# Altium schematic sheet LVDS_IFC.SchDoc: LVDS Interface
size 420 x 297 mm; Author: G.K.; CompanyName: WUT; DrawnBy: G.K.; Organization: CERN; Address1: Warsaw Univeristy of Technology; Address2: Nowowiejska 15/19; DocumentNumber: 4; Revision: -; SheetNumber: 4; SheetTotal: 5; EDA_Number: ARTIQ; Projet: 3U ADC; ModifiedBy: -; CreateDate: XX/XX/XXXX; CheckedDate: -; Title2: I2C logic; DivGrp: ISE; Designer: G.K.; ModifiedDate: -; ProjectName: 3U ADC
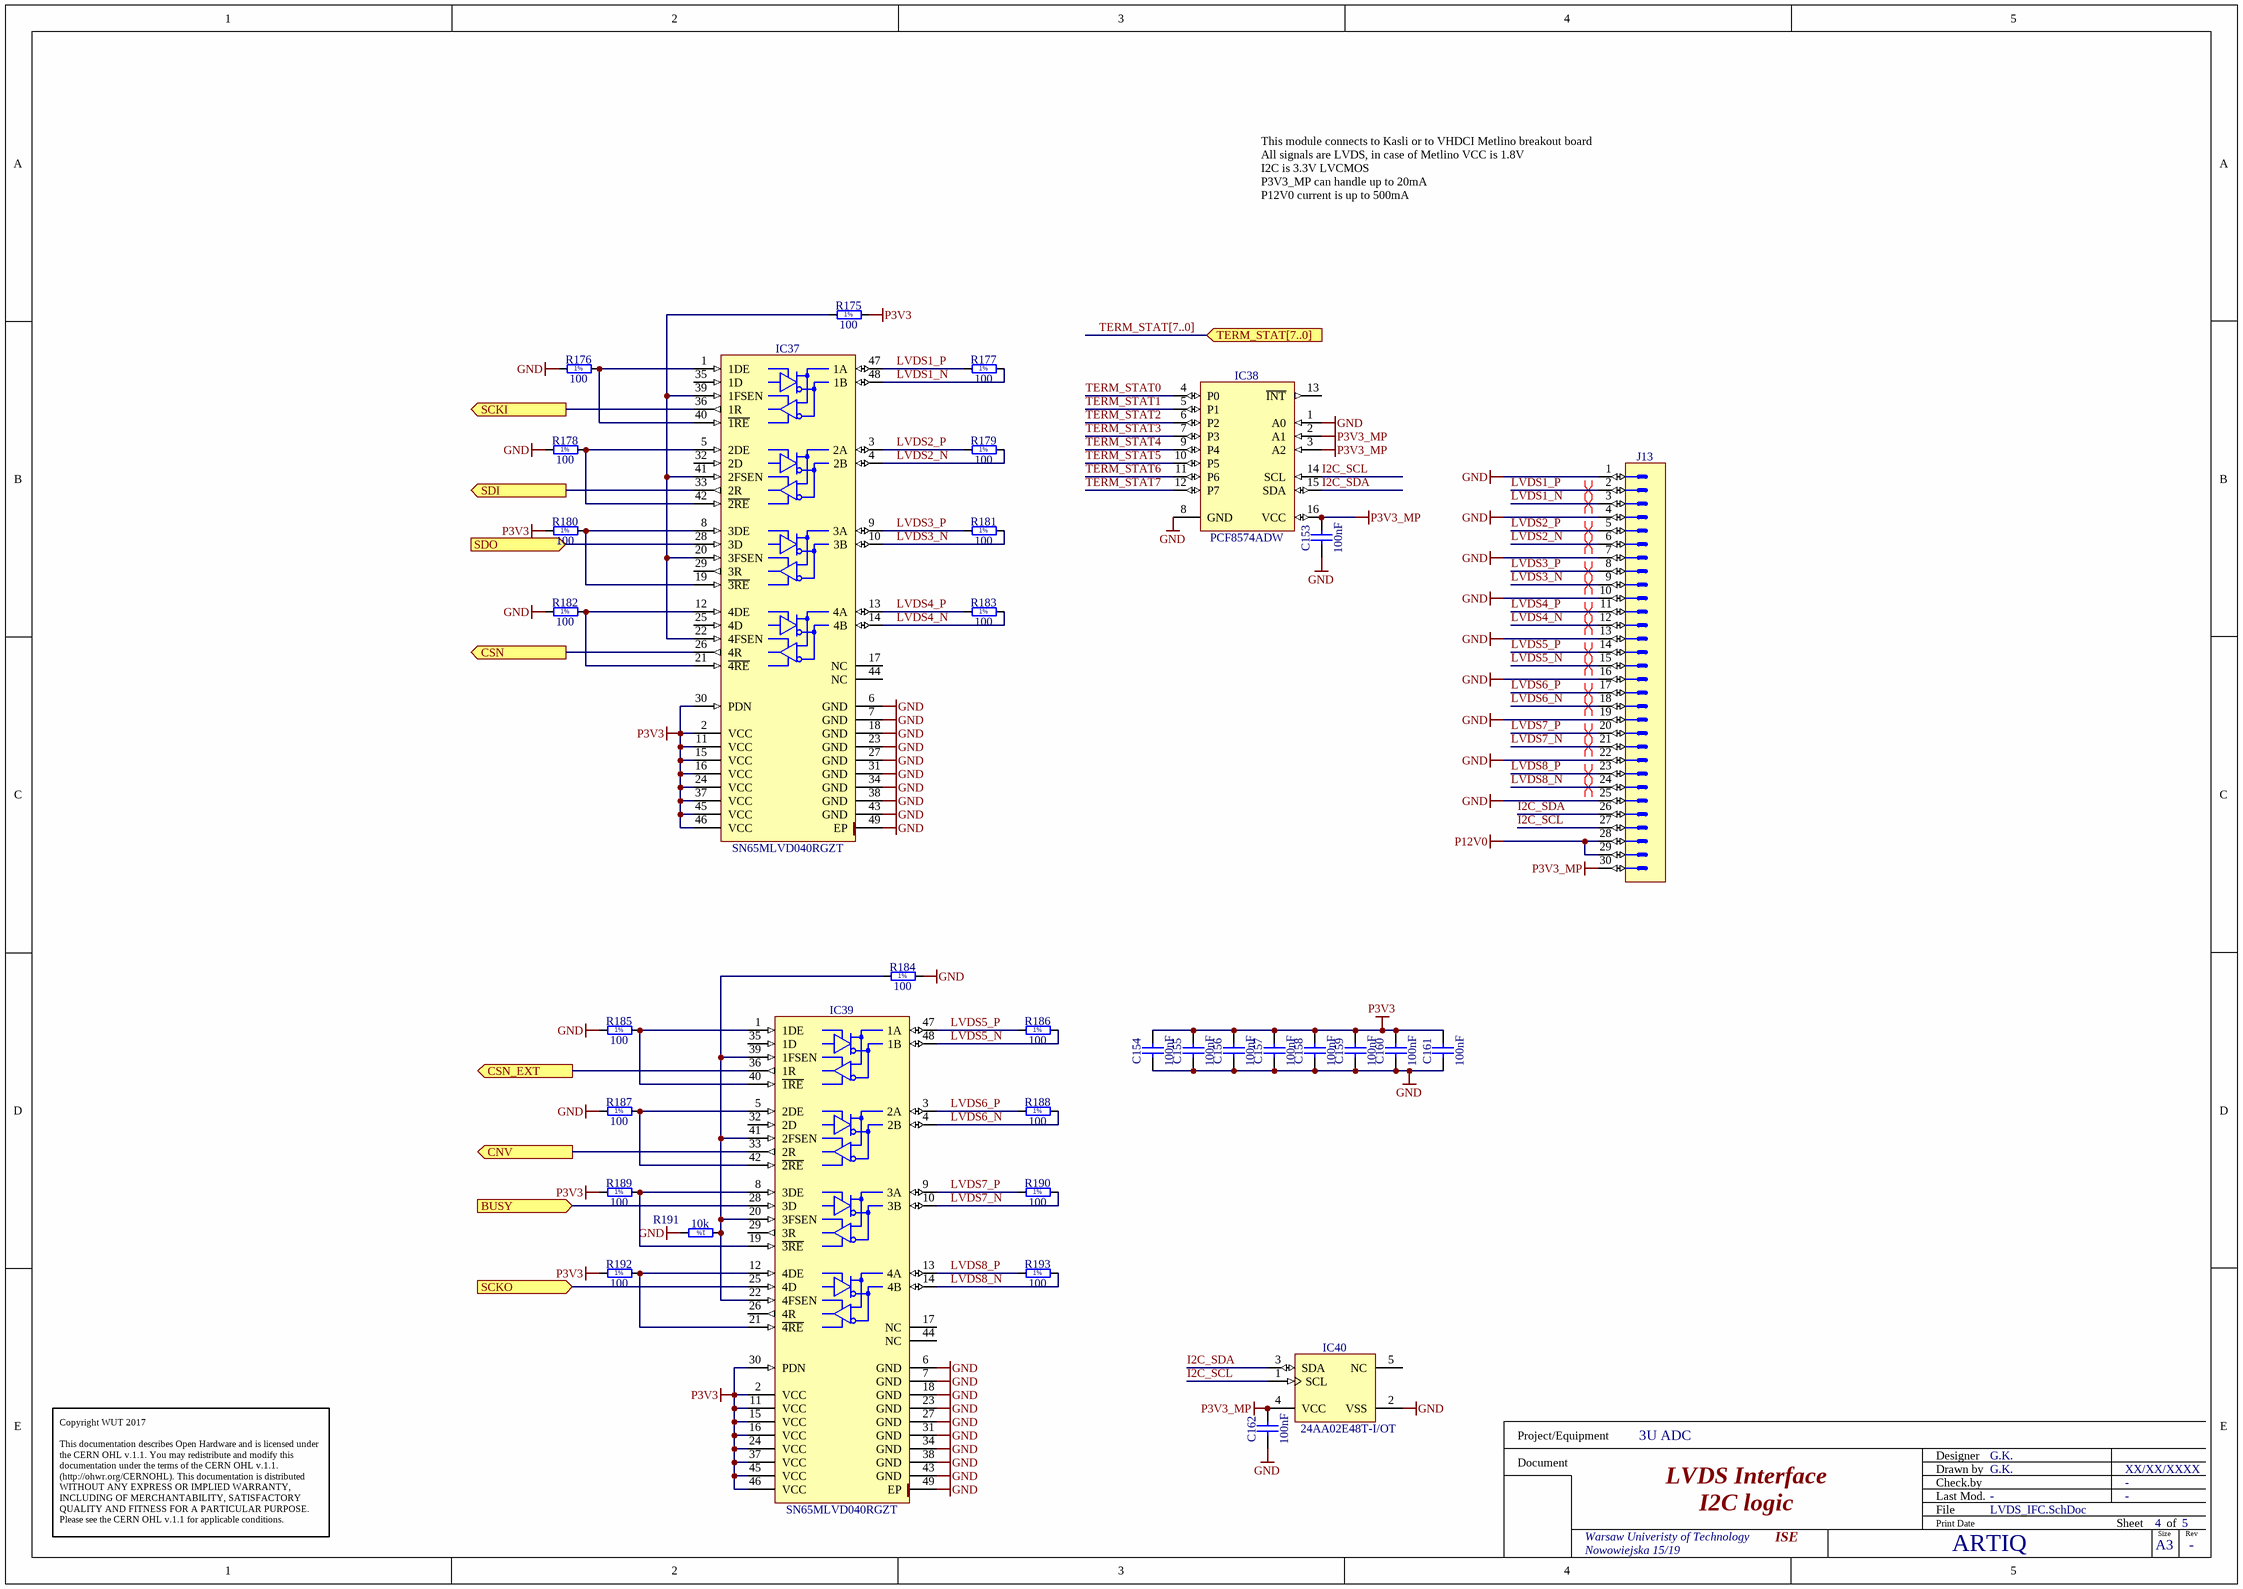
[diagram p0: LVDS_IFC.SchDoc]

## Parts
C153  100nF  [CAPC1005X55N]
C154  100nF  [CAPC1005X55N]
C155  100nF  [CAPC1005X55N]
C156  100nF  [CAPC1005X55N]
C157  100nF  [CAPC1005X55N]
C158  100nF  [CAPC1005X55N]
C159  100nF  [CAPC1005X55N]
C160  100nF  [CAPC1005X55N]
C161  100nF  [CAPC1005X55N]
C162  100nF  [CAPC1005X55N]
IC37  SN65MLVD040RGZT  [QFN50P700X700X100-49N-S420]
IC38  PCF8574ADW  [SOIC127P1030X265-16N]
IC39  SN65MLVD040RGZT  [QFN50P700X700X100-49N-S420]
IC40  24AA02E48T-I/OT  [SOT95P280X145-5N]
J13  (no value)  [3M_N2530-6002RB]
R175  100  [RESC1005X40N]
R176  100  [RESC1005X40N]
R177  100  [RESC1005X40N]
R178  100  [RESC1005X40N]
R179  100  [RESC1005X40N]
R180  100  [RESC1005X40N]
R181  100  [RESC1005X40N]
R182  100  [RESC1005X40N]
R183  100  [RESC1005X40N]
R184  100  [RESC1005X40N]
R185  100  [RESC1005X40N]
R186  100  [RESC1005X40N]
R187  100  [RESC1005X40N]
R188  100  [RESC1005X40N]
R189  100  [RESC1005X40N]
R190  100  [RESC1005X40N]
R191  10k  [RESC1005X40N]
R192  100  [RESC1005X40N]
R193  100  [RESC1005X40N]

## Ports
BUSY (in), CNV (out), CSN (out), CSN_EXT (out), SCKI (out), SCKO (in), SDI (out), SDO (in), TERM_STAT[7..0] (in)

## Nets
GND: C153.1 C154.1 C155.1 C156.1 C157.1 C158.1 C159.1 C160.1 C161.1 C162.1 IC37.6(GND) IC37.7(GND) IC37.18(GND) IC37.23(GND) IC37.27(GND) IC37.31(GND) IC37.34(GND) IC37.38(GND) IC37.43(GND) IC37.49(EP) IC38.1(A0) IC38.8(GND) IC39.6(GND) IC39.7(GND) IC39.18(GND) IC39.23(GND) IC39.27(GND) IC39.31(GND) IC39.34(GND) IC39.38(GND) IC39.43(GND) IC39.49(EP) IC40.2(VSS) J13.1 J13.4 J13.7 J13.10 J13.13 J13.16 J13.19 J13.22 J13.25 R176.1 R178.1 R182.1 R184.2 R185.1 R187.1 R191.2
P3V3: C154.2 C155.2 C156.2 C157.2 C158.2 C159.2 C160.2 C161.2 IC37.2(VCC) IC37.11(VCC) IC37.15(VCC) IC37.16(VCC) IC37.24(VCC) IC37.30(PDN) IC37.37(VCC) IC37.45(VCC) IC37.46(VCC) IC39.2(VCC) IC39.11(VCC) IC39.15(VCC) IC39.16(VCC) IC39.24(VCC) IC39.30(PDN) IC39.37(VCC) IC39.45(VCC) IC39.46(VCC) R175.2 R180.1 R189.1 R192.1
P3V3_MP: C153.2 C162.2 IC38.2(A1) IC38.3(A2) IC38.16(VCC) IC40.4(VCC) J13.30
P12V0: J13.28 J13.29
BUSY: IC39.28(3D) ; port BUSY
CNV: IC39.33(2R) ; port CNV
CSN: IC37.26(4R) ; port CSN
CSN_EXT: IC39.36(1R) ; port CSN_EXT
I2C_SCL: IC38.14(SCL) IC40.1(SCL) J13.27
I2C_SDA: IC38.15(SDA) IC40.3(SDA) J13.26
LVDS1_N: IC37.48(1B) J13.3 R177.2
LVDS1_P: IC37.47(1A) J13.2 R177.1
LVDS2_N: IC37.4(2B) J13.6 R179.2
LVDS2_P: IC37.3(2A) J13.5 R179.1
LVDS3_N: IC37.10(3B) J13.9 R181.2
LVDS3_P: IC37.9(3A) J13.8 R181.1
LVDS4_N: IC37.14(4B) J13.12 R183.2
LVDS4_P: IC37.13(4A) J13.11 R183.1
LVDS5_N: IC39.48(1B) J13.15 R186.2
LVDS5_P: IC39.47(1A) J13.14 R186.1
LVDS6_N: IC39.4(2B) J13.18 R188.2
LVDS6_P: IC39.3(2A) J13.17 R188.1
LVDS7_N: IC39.10(3B) J13.21 R190.2
LVDS7_P: IC39.9(3A) J13.20 R190.1
LVDS8_N: IC39.14(4B) J13.24 R193.2
LVDS8_P: IC39.13(4A) J13.23 R193.1
SCKI: IC37.36(1R) ; port SCKI
SCKO: IC39.25(4D) ; port SCKO
SDI: IC37.33(2R) ; port SDI
SDO: IC37.28(3D) ; port SDO
TERM_STAT0: IC38.4(P0)
TERM_STAT1: IC38.5(P1)
TERM_STAT2: IC38.6(P2)
TERM_STAT3: IC38.7(P3)
TERM_STAT4: IC38.9(P4)
TERM_STAT5: IC38.10(P5)
TERM_STAT6: IC38.11(P6)
TERM_STAT7: IC38.12(P7)
NetIC37_1: IC37.1(1DE) IC37.40(~{1RE}) R176.2
NetIC37_5: IC37.5(2DE) IC37.42(~{2RE}) R178.2
NetIC37_8: IC37.8(3DE) IC37.19(~{3RE}) R180.2
NetIC37_12: IC37.12(4DE) IC37.21(~{4RE}) R182.2
NetIC37_20: IC37.20(3FSEN) IC37.22(4FSEN) IC37.39(1FSEN) IC37.41(2FSEN) R175.1
NetIC39_1: IC39.1(1DE) IC39.40(~{1RE}) R185.2
NetIC39_5: IC39.5(2DE) IC39.42(~{2RE}) R187.2
NetIC39_8: IC39.8(3DE) IC39.19(~{3RE}) R189.2
NetIC39_12: IC39.12(4DE) IC39.21(~{4RE}) R192.2
NetIC39_20: IC39.20(3FSEN) IC39.22(4FSEN) IC39.39(1FSEN) IC39.41(2FSEN) R184.1 R191.1

Not connected (* = marked no-connect by the designer): IC37 17(NC) 25(4D) 29(3R) 32(2D) 35(1D) 44(NC); IC38 13(~{INT}); IC39 17(NC) 26(4R) 29(3R) 32(2D) 35(1D) 44(NC); IC40 5(NC)

## Buses and harness runs
bus TERM_STAT[7..0] = port TERM_STAT[7..0]

## Layout directives
differential pair: LVDS1_N, LVDS1_P, LVDS2_N, LVDS2_P, LVDS3_N, LVDS3_P, LVDS4_N, LVDS4_P, LVDS5_N, LVDS5_P, LVDS6_N, LVDS6_P, LVDS7_N, LVDS7_P, LVDS8_N, LVDS8_P

## Notes on the sheet
- This module connects to Kasli or to VHDCI Metlino breakout board
  All signals are LVDS, in case of Metlino VCC is 1.8V
  I2C is 3.3V LVCMOS
  P3V3_MP can handle up to 20mA
  P12V0 current is up to 500mA
- Copyright WUT 2017
  This documentation describes Open Hardware and is licensed under the CERN OHL v.1.1. You may redistribute and modify this documentation under the terms of the CERN OHL v.1.1. (http://ohwr.org/CERNOHL). This documentation is distributed WITHOUT ANY EXPRESS OR IMPLIED WARRANTY, INCLUDING OF MERCHANTABILITY, SATISFACTORY QUALITY AND FITNESS FOR A PARTICULAR PURPOSE. Please see the CERN OHL v.1.1 for applicable conditions.
- Project/Equipment
- Document
- Designer
- Drawn by
- Check.by
- File
- Last Mod.
- Print Date
- Sheet
- Size
- A3
- of
- Rev
- (in symbol R0402_10K_1%_0.0625W_100PPM) 1%
- (in symbol R0402_100R_1%_0.1W_100PPM) 1%

## Library data of the parts
C153-C162 = CC0402_100NF_16V_10%_X5R: Non-polarised capacitor; Part Description: SMD Multilayer Chip Ceramic Capacitor; Manufacturer: GENERIC; Manufacturer1 Part Number: GRM155R61C104KA88D; Voltage: 16V; TC: X5R; Tolerance: ±10%; Part Number: CC0402_100NF_16V_10%_X5R; Component Kind: Standard; Component Type: Standard; Pin Count: 2; Value: 100nF; Status: None; Manufacturer Part Number: CC0402_100NF_16V_10%_X5R; Case: 0402; Mounted: Yes; Socket: No; SMD: Yes; Sense: No; Manufacturer1 Example: MURATA; Manufacturer1 ComponentHeight: 0.55mm; HelpURL: \\cern.ch\dfs\Applications\Altium\Datasheets\CC0402_X5R_MURATA_GRM.pdf; Author: CERN DEM JLC; CreateDate: 10.12.2013; LatestRevisionDate: 10.12.2013
IC37 IC39 = SN65MLVD040RGZT: 4-Channel Half-Duplex M-LVDS Line Transceiver; Manufacturer: TEXAS INSTRUMENTS; PressFit: No; Bonding: No; Part Number: SN65MLVD040RGZT; Component Kind: Standard; Component Type: Standard; Device: SN65MLVD040RGZT; PackageDescription: QFN, 0.50mm Pitch, Square; 48 Pin, 7.00mm L X 7.00mm W X 1mm H body (W/Thermal Tab 4.2mm X 4.2mm), IPC Medium Density; Part Description: 4-Channel Half-Duplex M-LVDS Line Transceiver; Manufacturer Part Number: SN65MLVD040RGZT; Pin Count: 49; Case: QFN48; Mounted: Yes; Socket: No; SMD: Yes; Sense: No; ComponentHeight: 1mm; Author: CERN DEM JLC; HelpURL: \\cern.ch\dfs\Applications\Altium\Datasheets\SN65MLVD040RGZT.pdf; CreateDate: 17.03.2011; LatestRevisionDate: 17.03.2011
IC38 = PCF8574ADW: Remote 8-bit I/O Expander For I2C Bus; Manufacturer: TEXAS INSTRUMENTS; PressFit: No; Bonding: No; Part Number: PCF8574ADW; Component Kind: Standard; Component Type: Standard; Device: PCF8574ADW; PackageDescription: SOIC 16, Pitch 1.27mm - Body 7.5x10.3mm, IPC Medium Density; Part Description: Remote 8-bit I/O Expander For I2C Bus; Manufacturer Part Number: PCF8574ADW; Pin Count: 16; Case: SOIC16W; Mounted: Yes; Socket: No; SMD: Yes; Sense: No; ComponentHeight: 2.65mm; Author: CERN DEM JLC; HelpURL: \\cern.ch\dfs\Applications\Altium\Datasheets\PCF8574ADW.pdf; CreateDate: 01.11.2012; LatestRevisionDate: 01.11.2012
IC40 = 24AA02E48T-I/OT: 1.7V-5.5V, 2K I2C Serial EEPROM With EUI-48 Node Identity; Manufacturer: MICROCHIP TECHNOLOGY; PressFit: No; Bonding: No; Part Number: 24AA02E48T-I/OT; Component Kind: Standard; Component Type: Standard; Device: 24AA02E48T-I/OT; PackageDescription: SOT, 0.95mm pitch; 5 pin, 1.60mm W X 2.90mm L X 1.45mm H body, IPC Medium Density; Part Description: 1.7V-5.5V, 2K I2C Serial EEPROM With EUI-48 Node Identity; Manufacturer Part Number: 24AA02E48T-I/OT; Pin Count: 5; Case: SOT23-5; Mounted: Yes; Socket: No; SMD: Yes; Sense: No; ComponentHeight: 1.45mm; HelpURL: \\cern.ch\dfs\Applications\Altium\Datasheets\24AA02E48T-I-OT.pdf; Author: CERN DEM MR; CreateDate: 31.03.2016; LatestRevisionDate: 31.03.2016
J13 = 3M_N2530-6002RB: Connector 30 Male; Part Description: 30 Contacts - Straight .100'' x .100'' Low Profile Four-Wall Header, 2500 Series; Manufacturer: 3M; PressFit: No; Part Number: 3M_N2530-6002RB; Component Kind: Standard; Component Type: Standard; Pin Count: 30; Family: Header 30; Mounted: Yes; Socket: No; SMD: No; Sense: No; Status: None; Manufacturer Part Number: N2530-6002RB; ComponentHeight: 10.03mm; HelpURL: \\cern.ch\dfs\Applications\Altium\Datasheets\3M_N2530-6002RB.pdf; Author: CERN DEM JLC; CreateDate: 11.02.2009; LatestRevisionDate: 11.08.2009
R175-R190 R192 R193 = R0402_100R_1%_0.1W_100PPM: Resistor - 1%; Part Description: General Purpose Thick Film Chip Resistor; Manufacturer: GENERIC; Manufacturer Part Number: R0402_100R_1%_0.1W_100PPM_50V; Manufacturer1 Part Number: ERJ2RKF1000X; Power: 0.1W; TC: ±100ppm/°C; Voltage: 50V; Part Number: R0402_100R_1%_0.1W_100PPM; Component Kind: Standard; Component Type: Standard; Pin Count: 2; Value: 100; Status: Not recommended; Tolerance: ±1%; Case: 0402; Mounted: Yes; Sense: No; Socket: No; SMD: Yes; Manufacturer1 Example: PANASONIC; Manufacturer1 ComponentHeight: 0.4mm; HelpURL: \\cern.ch\dfs\Applications\Altium\Datasheets\R0402_PANASONIC_ERJ2RK.pdf; Author: CERN DEM JLC; CreateDate: 12.12.2013; LatestRevisionDate: 03.03.2015
R191 = R0402_10K_1%_0.0625W_100PPM: Resistor - 1%; Part Description: General Purpose Thick Film Chip Resistor; Manufacturer: GENERIC; Manufacturer1 Part Number: 232270671003L; TC: ±100ppm/°C; Part Number: R0402_10K_1%_0.0625W_100PPM; Component Kind: Standard; Component Type: Standard; Pin Count: 2; Value: 10k; Status: Not recommended; Power: 0.0625W; Tolerance: ±1%; Manufacturer Part Number: R0402_10K_1%_0.0625W_100PPM; Case: 0402; Mounted: Yes; Sense: No; Socket: No; SMD: Yes; Manufacturer1 Example: YAGEO PHYCOMP; Manufacturer1 ComponentHeight: 0.4mm; HelpURL: \\cern.ch\dfs\Applications\Altium\Datasheets\R0402_Phycomp_RC0402.pdf; Author: CERN DEM JLC; CreateDate: 03.12.2007; LatestRevisionDate: 17.10.2012